# Altium project fpga_board.PrjPcb (part 1 of 2)
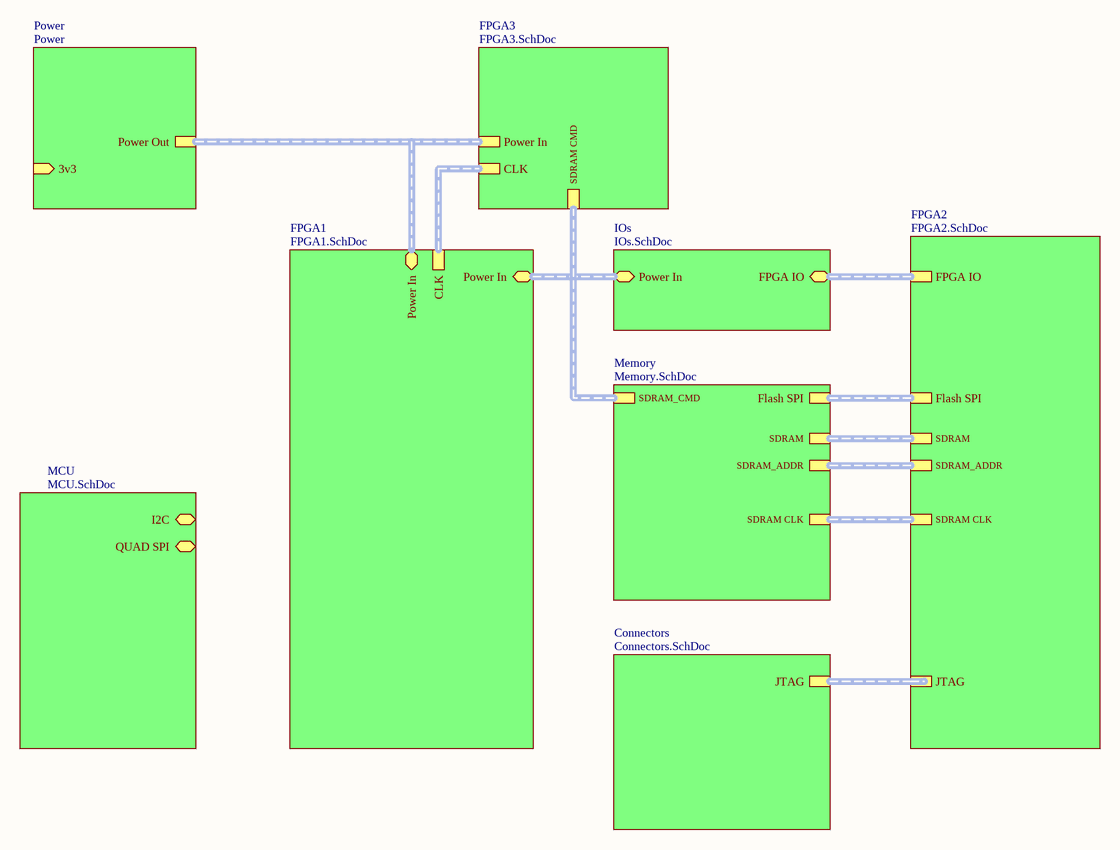
[diagram p0: root.SchDoc]
9 sheets, 164 parts. Net scope: hierarchical (ports join the sheet entries above them; power ports are global).
Board file: fpga_board.PcbDoc
Sheets:
  root.SchDoc
    FPGA1 = FPGA1.SchDoc
    IOs = IOs.SchDoc
    Power = Power.SchDoc
    Memory = Memory.SchDoc
    Connectors = Connectors.SchDoc
    MCU = MCU.SchDoc
    FPGA2 = FPGA2.SchDoc
    FPGA3 = FPGA3.SchDoc

## Sheet root.SchDoc
size A4; SheetNumber: 1; SheetTotal: 9

### Sub-sheets
Connectors = Connectors.SchDoc: JTAG
FPGA1 = FPGA1.SchDoc: Power In (bidir), CLK, Power In (bidir)
FPGA2 = FPGA2.SchDoc: FPGA IO, Flash SPI, SDRAM, SDRAM_ADDR, JTAG, SDRAM CLK
FPGA3 = FPGA3.SchDoc: Power In, CLK, SDRAM CMD
IOs = IOs.SchDoc: FPGA IO (bidir), Power In (bidir)
MCU = MCU.SchDoc: I2C (bidir), QUAD SPI (bidir)
Memory = Memory.SchDoc: Flash SPI, SDRAM, SDRAM_ADDR, SDRAM_CMD, SDRAM CLK
Power = Power: 3v3 (in), Power Out

### Buses and harness runs
harness sheet Connectors/JTAG = sheet FPGA2/JTAG
harness sheet FPGA1/CLK = sheet FPGA3/CLK
harness sheet FPGA1/Power In = sheet FPGA3/Power In = sheet Power/Power Out
harness sheet FPGA1/Power In = sheet IOs/Power In
harness sheet FPGA2/Flash SPI = sheet Memory/Flash SPI
harness sheet FPGA2/FPGA IO = sheet IOs/FPGA IO
harness sheet FPGA2/SDRAM = sheet Memory/SDRAM
harness sheet FPGA2/SDRAM CLK = sheet Memory/SDRAM CLK
harness sheet FPGA2/SDRAM_ADDR = sheet Memory/SDRAM_ADDR
harness sheet FPGA3/SDRAM CMD = sheet Memory/SDRAM_CMD

## Sheet FPGA1.SchDoc
size A4; SheetNumber: 2; SheetTotal: 9
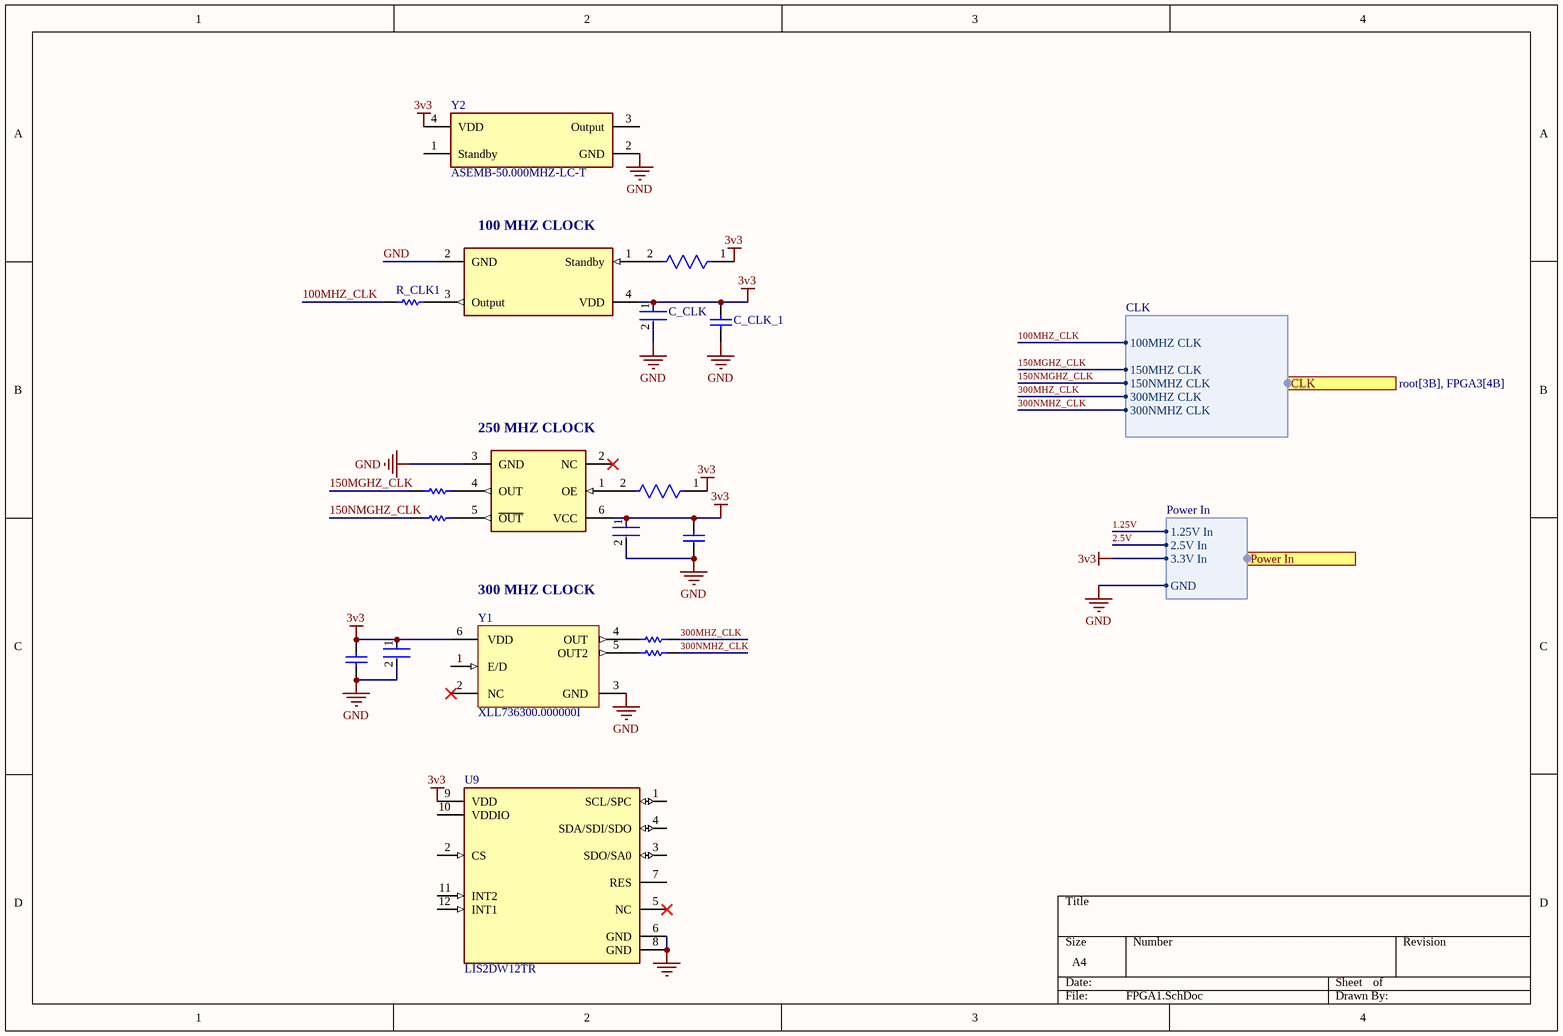
[diagram p1: FPGA1.SchDoc]

### Parts
100MHZ_CLK  ASEM1-100.000MHZ-LC-T  [FP-ASEM-MFG]  (value not drawn)
250_MHZ_CLK  SG3225VAN 250.000000M-KEGA3  [FP-SG3225-MFG]  (value not drawn)
C_CLK  GRM033C71C104KE14D  [FP-GRM033-0_03-MFG]  (value not drawn)
C_CLK_1  C0805C105K8PACTU  [CAPC2013X145X50NL20T25]  (value not drawn)
C_CLK_3  C0805C105K8PACTU  [CAPC2013X145X50NL20T25]  (value not drawn)
C_CLK_4  GRM033C71C104KE14D  [FP-GRM033-0_03-MFG]  (value not drawn)
C_CLK_t5  C0805C105K8PACTU  [CAPC2013X145X50NL20T25]  (value not drawn)
C_CLKt  GRM033C71C104KE14D  [FP-GRM033-0_03-MFG]  (value not drawn)
R_CLK1  CRCW080522R0JNTA  [RESC2013X50X30NL20T20]  (value not drawn)
R_CLK2  CRCW080522R0JNTA  [RESC2013X50X30NL20T20]  (value not drawn)
R_CLK3  CRCW080522R0JNTA  [RESC2013X50X30NL20T20]  (value not drawn)
R_CLK_4  CRCW080522R0JNTA  [RESC2013X50X30NL20T20]  (value not drawn)
R_CLK_5  CRCW080522R0JNTA  [RESC2013X50X30NL20T20]  (value not drawn)
R_STDBY1  RT0402BRE0710KL  [FP-RT0402-MFG]  (value not drawn)
R_STDBY_2  RT0402BRE0710KL  [FP-RT0402-MFG]  (value not drawn)
U9  LIS2DW12TR  [FP-LGA12-DM00170568-MFG]
Y1  XLL736300.000000I  [JU6_MFG]
Y2  ASEMB-50.000MHZ-LC-T  [FP-ASEMB-MFG]

### Ports
CLK (harness CLK, see root[3B], FPGA3[4B]), Power In (harness Power In, see root[2B], FPGA3[4C], IOs[1D])

### Harnesses
Power In: 1.25V In, 2.5V In, 3.3V In, GND
CLK: 100MHZ CLK, 150MHZ CLK, 150NMHZ CLK, 300MHZ CLK, 300NMHZ CLK

### Nets
3v3: 100MHZ_CLK.4(VDD) 250_MHZ_CLK.6(VCC) C_CLK.1 C_CLK_1.2 C_CLK_3.2 C_CLK_4.1 C_CLK_t5.2 C_CLKt.1 R_STDBY1.1 R_STDBY_2.1 U9.9(VDD) Y1.6(VDD) Y2.4(VDD) ; port Power In.3.3V In
GND: 100MHZ_CLK.2(GND) 250_MHZ_CLK.3(GND) C_CLK.2 C_CLK_1.1 C_CLK_3.1 C_CLK_4.2 C_CLK_t5.1 C_CLKt.2 U9.6(GND) U9.8(GND) Y1.3(GND) Y2.2(GND) ; port Power In.GND
1.25V: port Power In.1.25V In
100MHZ_CLK: R_CLK1.1 ; port CLK.100MHZ CLK
150MGHZ_CLK: R_CLK2.1 ; port CLK.150MHZ CLK
150NMGHZ_CLK: R_CLK3.1 ; port CLK.150NMHZ CLK
300MHZ_CLK: R_CLK_5.2 ; port CLK.300MHZ CLK
300NMHZ_CLK: R_CLK_4.2 ; port CLK.300NMHZ CLK
Net100MHZ_CLK_1: 100MHZ_CLK.1(Standby) R_STDBY1.2
Net100MHZ_CLK_3: 100MHZ_CLK.3(Output) R_CLK1.2
Net250_MHZ_CLK_1: 250_MHZ_CLK.1(OE) R_STDBY_2.2
Net250_MHZ_CLK_4: 250_MHZ_CLK.4(OUT) R_CLK2.2
Net250_MHZ_CLK_5: 250_MHZ_CLK.5(~{OUT}) R_CLK3.2
NetR_CLK_4_1: R_CLK_4.1 Y1.5(OUT2)
NetR_CLK_5_1: R_CLK_5.1 Y1.4(OUT)

Not connected (* = marked no-connect by the designer): 250_MHZ_CLK 2(NC)*; U9 1(SCL/SPC) 2(CS) 3(SDO/SA0) 4(SDA/SDI/SDO) 5(NC)* 7(RES) 10(VDDIO) 11(INT2) 12(INT1); Y1 1(E/D) 2(NC)*; Y2 1(Standby) 3(Output)

### Notes on the sheet
- (near 100MHZ_CLK) 100 MHZ CLOCK
- (near 250_MHZ_CLK) 250 MHZ CLOCK
- 300 MHZ CLOCK

### Library data of the parts
100MHZ_CLK = CMP-27762-005945-1: MEMS OSC XO 100.0000MHZ CMOS SMD; Min Supply Voltage: 3V; Frequency: 100MHz; Load Capacitance: 15pF; Max Supply Current: 10mA; Operating Supply Voltage: 3.3V; Max Supply Voltage: 3.6V; Frequency Stability: 50ppm; Min Operating Temperature: -40°C; Radiation Hardening: No; Series: Pure Silicon™ ASEM; Lead Free: Lead Free; Width: 0.098inch; Max Operating Temperature: 85°C; Mount: Surface Mount; Packaging: Tape and Reel; Length: 0.126inch; Number of Pins: 4; Height: 0.035inch; Case/Package: SMD/SMT
250_MHZ_CLK = CMP-36405-000003-1: XTAL OSC XO 250.0000MHZ LVDS SMD; Manufacturer: EPSON; Min Supply Voltage: 2.5V; Max Supply Voltage: 3.3V; Frequency: 250MHz; Max Supply Current: 30mA; Device Class L1: Passive Components; RoHS: TRUE; Lead Free: Yes; Manufacturer Part Number: SG3225VAN 250.000000M-KEGA3; Height: 1.2mm; Temperature: -40°C to +85°C; Mouser Description: Standard Clock Oscillators 250MHz 30ppm -40C +85C; Automotive: No; Temperature Range Low: -40°C; Digikey Description: XTAL OSC XO 250.0000MHZ LVDS SMD; Device Class L2: Crystals / Oscillators; ComponentLink2URL: https://support.epson.biz/td/api/doc_check.php?dl=brief_SG5032VAN&lang=en; Temperature Range High: +85°C; ComponentLink2Description: Datasheet; Series: SG3225; Category: Crys; Octopart: https://octopart.com/sg3225van+250.000000m-kega3-epson-56783964; Package: SG3225; Device Class L3: Oscillators
C_CLK C_CLK_4 C_CLKt = CMP-06035-019037-1: Chip Multilayer Ceramic Capacitors for General Purpose, 0201, 0.10uF, X7S, 22%, 10%, 16V; Capacitance: 100nF; Dielectric: X7S; Tolerance: 10%; Voltage Rating (DC): 16V; Height: 0.3mm; Max Operating Temperature: 125°C; Case Code (Metric): 0603; Termination: SMD/SMT; Min Operating Temperature: -55°C; Mount: Surface Mount; Case/Package: 0201; Weight: 1.2E-05oz; Package Quantity: 15000; Length: 0.024inch; Voltage Rating: 16V; Case Code (Imperial): 0201; Packaging: Tape and Reel; Thickness: 0.013inch; Width: 0.3mm
C_CLK_1 C_CLK_3 C_CLK_t5 = CMP-2007-01022-1: Manufacturer: Kemet; Part Number: C0805C105K8PACTU
R_CLK1-R_CLK3 R_CLK_4 R_CLK_5 = CMP-2001-03694-1: Manufacturer: Vishay Dale; Part Number: CRCW080522R0JNTA
R_STDBY1 R_STDBY_2 = CMP-2002-02973-2: RES SMD 10K OHM 0.1% 1/16W 0402; Manufacturer: Yageo; Power Rating: 0.063W; Resistance: 10KΩ; Temperature Coefficient: 50 ppm/°C; Tolerance: 0.001; Voltage Rating: 50V; Value: 10KΩ; Octopart: https://octopart.com/rt0402bre0710kl-yageo-1416557; Digikey Description: RES SMD 10K OHM 0.1% 1/16W 0402; Category: Res; Temperature Range Low: -55°C; Ipc Land Pattern Name: RESC10050X30; Manufacturer Part Number: RT0402BRE0710KL; Automotive: No; Package: RT0402; Temperature: -55°C to +155°C; Series: RT; Lead Free: Yes; Device Class L3: Chip SMD Resistors; ComponentLink2URL: http://www.yageo.com/documents/recent/PYu-RT_1-to-0.01_RoHS_L_9.pdf; Height: 0.35mm; ComponentLink2Description: Datasheet; RoHS: TRUE; Composition: Thin Film; Device Class L2: Resistors; Device Class L1: Passive Components; Temperature Range High: +155°C; Footprint Url: http://www.yageo.com/exep/pages/download/literatures/PYu-R_Mount_10.pdf; Mouser Description: Res Thin Film 0402 10K Ohm 0.1% 1/16W ±50ppm/°C Molded SMD Paper T/R
U9 = CMP-12175-000006-1: ACCEL 2-16G I2C/SPI 12LGA; Manufacturer: STMicroelectronics; Min Supply Voltage: 1.62V; Operating Supply Current: 0.38-90uA; Sensor Output: I2C,SPI; Accel Resolution: 14bits; Max Supply Voltage: 3.6V; Accel Range: 2/4/8/16g; Height: 0.7mm; Device Class L1: Sensors; RoHS: TRUE; Temperature Range Low: -40°C; Category: IC; Mouser Description: Accelerometer Triple ±2g/±4g/±8g/±16g 1.62V to 3.6V 0.244mg/digit/0.488mg/digit/0.976mg/digit/1.952mg/digit 12-Pin LG...; Digikey Description: ACCEL 2-16G I2C/SPI 12LGA; ComponentLink2URL: https://www.st.com/resource/en/datasheet/lis2dw12.pdf; Automotive: No; Manufacturer Part Number: LIS2DW12TR; Lead Free: Yes; Footprint Url: https://www.st.com/content/ccc/resource/technical/document/technical_note/73/17/9c/16/dd/96/4a/01/CD00134799.pdf/files/CD00134799.pdf/jcr:content/translations/en.CD00134799.pdf; Temperature: -40°C to +85°C; Device Class L3: Accelerometers; Package: LGA12-DM00170568; Temperature Range High: +85°C; Device Class L2: Motion Sensors; Octopart: https://octopart.com/lis2dw12tr-stmicroelectronics-77080925; ComponentLink2Description: Datasheet
Y1 = CMP-00572-106942874-3: Renesas XL Family of Low Phase Noise Quartz-based PLL Oscillators; Min Input Voltage: 3.135V; Max Input Voltage: 3.465V; Max Output Frequency: 999.9MHz; Output Type: LVDS; Height: 1.45mm; ComponentLink1Description: Manufacturer's Website; Case/Package: CLCC; ComponentLink2URL: https://octopart.com/cad-content/api/get-model-datasheet/15189/106942874; ComponentLink2Description: Datasheet URL; RoHS: Compliant; Number of Pins: 6; Mount: Surface Mount; ComponentLink3Description: Manufacturer's Package Drawing; Max Operating Temperature: 85°C; Min Operating Temperature: -40°C; HelpURL: https://octopart.com/cad-content/api/get-model-datasheet/15189/106942874; ComponentLink3URL: https://www.renesas.com/en/document/psc/ju6-package-outline-70-x-50-mm-body-13-mm-thick; ComponentLink1URL: http://www.renesas.com
Y2 = CMP-27762-007622-1: MEMS OSC XO 50.0000MHZ CMOS SMD; Operating Supply Voltage: 3.3V; Frequency Stability: 50ppm; Frequency: 50MHz; Max Supply Voltage: 4V; Load Capacitance: 15pF; Max Supply Current: 16mA; Min Supply Voltage: -300mV; Min Operating Temperature: -40°C; Mount: Surface Mount; Lead Free: Lead Free; Series: Pure Silicon™ ASEMB; Termination: SMD/SMT; Number of Pins: 4; REACH SVHC: No SVHC; Width: 0.098inch; Case/Package: SMD/SMT; Length: 0.126inch; Packaging: Tape and Reel; Max Operating Temperature: 85°C; Height: 0.035inch

## Sheet IOs.SchDoc
size A4; SheetNumber: 3; SheetTotal: 9
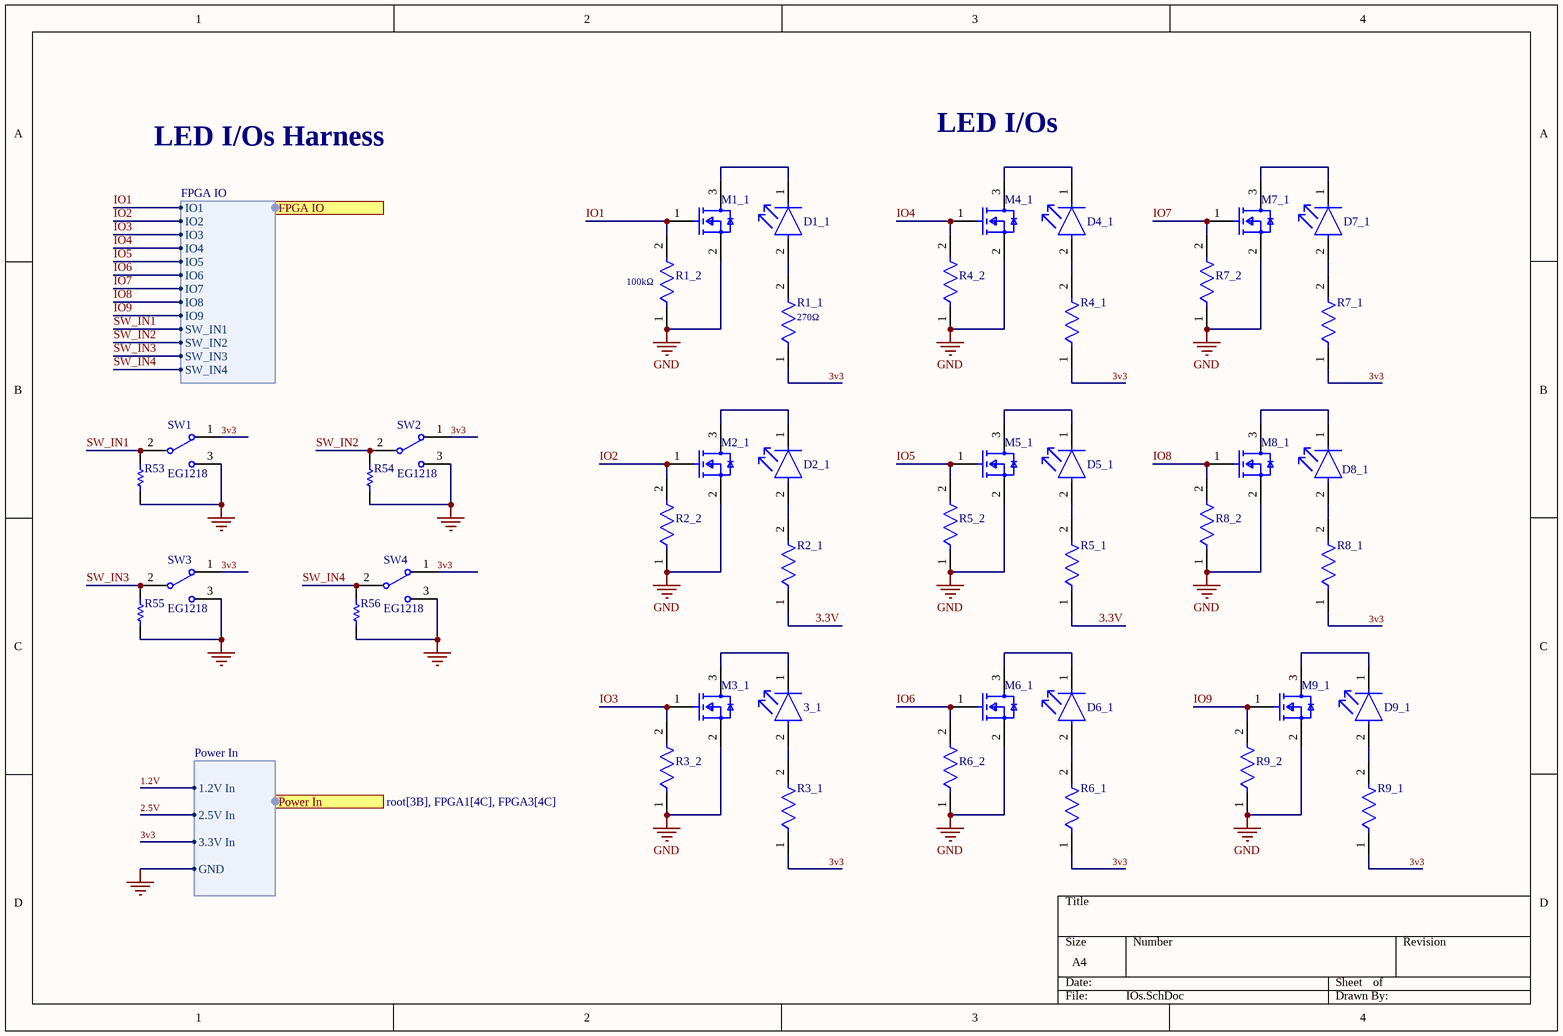
[diagram p2: IOs.SchDoc]

### Parts
3_1  LW T6SH.CB-CZEY-FK0PM0-Z664  [FP-LW_T6SH_CB-CZEY-FK0PM0-MFG]  (value not drawn)
D1_1  LW T6SH.CB-CZEY-FK0PM0-Z664  [FP-LW_T6SH_CB-CZEY-FK0PM0-MFG]  (value not drawn)
D2_1  LW T6SH.CB-CZEY-FK0PM0-Z664  [FP-LW_T6SH_CB-CZEY-FK0PM0-MFG]  (value not drawn)
D4_1  LW T6SH.CB-CZEY-FK0PM0-Z664  [FP-LW_T6SH_CB-CZEY-FK0PM0-MFG]  (value not drawn)
D5_1  LW T6SH.CB-CZEY-FK0PM0-Z664  [FP-LW_T6SH_CB-CZEY-FK0PM0-MFG]  (value not drawn)
D6_1  LW T6SH.CB-CZEY-FK0PM0-Z664  [FP-LW_T6SH_CB-CZEY-FK0PM0-MFG]  (value not drawn)
D7_1  LW T6SH.CB-CZEY-FK0PM0-Z664  [FP-LW_T6SH_CB-CZEY-FK0PM0-MFG]  (value not drawn)
D8_1  LW T6SH.CB-CZEY-FK0PM0-Z664  [FP-LW_T6SH_CB-CZEY-FK0PM0-MFG]  (value not drawn)
D9_1  LW T6SH.CB-CZEY-FK0PM0-Z664  [FP-LW_T6SH_CB-CZEY-FK0PM0-MFG]  (value not drawn)
M1_1  SI2342DS-T1-GE3  [FP-S-03946-MFG]  (value not drawn)
M2_1  SI2342DS-T1-GE3  [FP-S-03946-MFG]  (value not drawn)
M3_1  SI2342DS-T1-GE3  [FP-S-03946-MFG]  (value not drawn)
M4_1  SI2342DS-T1-GE3  [FP-S-03946-MFG]  (value not drawn)
M5_1  SI2342DS-T1-GE3  [FP-S-03946-MFG]  (value not drawn)
M6_1  SI2342DS-T1-GE3  [FP-S-03946-MFG]  (value not drawn)
M7_1  SI2342DS-T1-GE3  [FP-S-03946-MFG]  (value not drawn)
M8_1  SI2342DS-T1-GE3  [FP-S-03946-MFG]  (value not drawn)
M9_1  SI2342DS-T1-GE3  [FP-S-03946-MFG]  (value not drawn)
R1_1  270Ω  [FP-CR0402-IPC_A]
R1_2  100kΩ  [FP-TFCR0402-IPC_B]
R2_1  CR0402-JW-271GLF  [FP-CR0402-IPC_A]  (value not drawn)
R2_2  100kΩ  [FP-TFCR0402-IPC_B]  (value not drawn)
R3_1  CR0402-JW-271GLF  [FP-CR0402-IPC_A]  (value not drawn)
R3_2  100kΩ  [FP-TFCR0402-IPC_B]  (value not drawn)
R4_1  CR0402-JW-271GLF  [FP-CR0402-IPC_A]  (value not drawn)
R4_2  100kΩ  [FP-TFCR0402-IPC_B]  (value not drawn)
R5_1  CR0402-JW-271GLF  [FP-CR0402-IPC_A]  (value not drawn)
R5_2  100kΩ  [FP-TFCR0402-IPC_B]  (value not drawn)
R6_1  CR0402-JW-271GLF  [FP-CR0402-IPC_A]  (value not drawn)
R6_2  100kΩ  [FP-TFCR0402-IPC_B]  (value not drawn)
R7_1  CR0402-JW-271GLF  [FP-CR0402-IPC_A]  (value not drawn)
R7_2  100kΩ  [FP-TFCR0402-IPC_B]  (value not drawn)
R8_1  CR0402-JW-271GLF  [FP-CR0402-IPC_A]  (value not drawn)
R8_2  100kΩ  [FP-TFCR0402-IPC_B]  (value not drawn)
R9_1  CR0402-JW-271GLF  [FP-CR0402-IPC_A]  (value not drawn)
R9_2  100kΩ  [FP-TFCR0402-IPC_B]  (value not drawn)
R53  3K3 5% 0603(1608)  [RESC0603(1608)_N]  (value not drawn)
R54  3K3 5% 0603(1608)  [RESC0603(1608)_N]  (value not drawn)
R55  3K3 5% 0603(1608)  [RESC0603(1608)_N]  (value not drawn)
R56  3K3 5% 0603(1608)  [RESC0603(1608)_N]  (value not drawn)
SW1  EG1218  [ESWI-EG1218_V]
SW2  EG1218  [ESWI-EG1218_V]
SW3  EG1218  [ESWI-EG1218_V]
SW4  EG1218  [ESWI-EG1218_V]

### Ports
FPGA IO (harness FPGA IO, see root[4B], FPGA2[3A]), Power In (harness Power In, see root[3B], FPGA1[4C], FPGA3[4C])

### Harnesses
FPGA IO: IO1, IO2, IO3, IO4, IO5, IO6, IO7, IO8, IO9, SW_IN1, SW_IN2, SW_IN3, SW_IN4
Power In: 1.2V In, 2.5V In, 3.3V In, GND

### Nets
3v3: R1_1.1 R3_1.1 R4_1.1 R6_1.1 R7_1.1 R8_1.1 R9_1.1 SW1.1 SW2.1 SW3.1 SW4.1 ; port Power In.3.3V In
GND: M1_1.2(S) M2_1.2(S) M3_1.2(S) M4_1.2(S) M5_1.2(S) M6_1.2(S) M7_1.2(S) M8_1.2(S) M9_1.2(S) R1_2.1 R2_2.1 R3_2.1 R4_2.1 R5_2.1 R6_2.1 R7_2.1 R8_2.1 R9_2.1 R53.1 R54.1 R55.1 R56.1 SW1.3 SW2.3 SW3.3 SW4.3 ; port Power In.GND
3.3V: R2_1.1 R5_1.1
IO1: M1_1.1(G) R1_2.2 ; port FPGA IO.IO1
IO2: M2_1.1(G) R2_2.2 ; port FPGA IO.IO2
IO3: M3_1.1(G) R3_2.2 ; port FPGA IO.IO3
IO4: M4_1.1(G) R4_2.2 ; port FPGA IO.IO4
IO5: M5_1.1(G) R5_2.2 ; port FPGA IO.IO5
IO6: M6_1.1(G) R6_2.2 ; port FPGA IO.IO6
IO7: M7_1.1(G) R7_2.2 ; port FPGA IO.IO7
IO8: M8_1.1(G) R8_2.2 ; port FPGA IO.IO8
IO9: M9_1.1(G) R9_2.2 ; port FPGA IO.IO9
SW_IN1: R53.2 SW1.2(COM) ; port FPGA IO.SW_IN1
SW_IN2: R54.2 SW2.2(COM) ; port FPGA IO.SW_IN2
SW_IN3: R55.2 SW3.2(COM) ; port FPGA IO.SW_IN3
SW_IN4: R56.2 SW4.2(COM) ; port FPGA IO.SW_IN4
Net3_1_1: 3_1.1(C) M3_1.3(D)
Net3_1_2: 3_1.2(A) R3_1.2
NetD1_1_1: D1_1.1(C) M1_1.3(D)
NetD1_1_2: D1_1.2(A) R1_1.2
NetD2_1_1: D2_1.1(C) M2_1.3(D)
NetD2_1_2: D2_1.2(A) R2_1.2
NetD4_1_1: D4_1.1(C) M4_1.3(D)
NetD4_1_2: D4_1.2(A) R4_1.2
NetD5_1_1: D5_1.1(C) M5_1.3(D)
NetD5_1_2: D5_1.2(A) R5_1.2
NetD6_1_1: D6_1.1(C) M6_1.3(D)
NetD6_1_2: D6_1.2(A) R6_1.2
NetD7_1_1: D7_1.1(C) M7_1.3(D)
NetD7_1_2: D7_1.2(A) R7_1.2
NetD8_1_1: D8_1.1(C) M8_1.3(D)
NetD8_1_2: D8_1.2(A) R8_1.2
NetD9_1_1: D9_1.1(C) M9_1.3(D)
NetD9_1_2: D9_1.2(A) R9_1.2

### Notes on the sheet
- LED I/Os Harness
- LED I/Os

### Library data of the parts
3_1 D1_1 D2_1 D4_1 D5_1 D6_1 D7_1 D8_1 D9_1 = CMP-62016-000075-1: TOPLED
M1_1 M2_1 M3_1 M4_1 M5_1 M6_1 M7_1 M8_1 M9_1 = CMP-02550-000018-1: MOSFET N-CH 8V 6A SOT-23; Manufacturer: Vishay; Number Of N Channels: 1; Pulse Drain Current: 30A; Reverse Recovery Charge: 17nC; Depletion Mode: False; Reverse Recovery Time: 40ns; Max Junction Temp: +150°C; Power Dissipation: 1.3W; Transconductance: 75S; Threshold Vgs Min: 0.35V; Turn Off Delay Time: 65ns; Rthja Max: 75°C/W; Input Capacitace At Vds: 1070pF @ 4V; Gate Charge At Vgs: 10.5nC @ 4.5V; Gate To Source Voltage: 5V; Turn On Delay Time: 6ns; Drain To Source Resistance: 0.014Ω; Typ Forward Diode Voltage: 0.82V; Standoff Height: 0.01mm; Max Forward Diode Voltage: 1.2V; Threshold Vgs Max: 0.8V; Continuous Drain Current: 6A; Device Class L1: Discrete Semiconductors; Mouser Description: MOSFET 8V 6A 2.5; Category: Trans; Digikey Description: MOSFET N-CH 8V 6A SOT-23; Manufacturer Part Number: SI2342DS-T1-GE3; Device Class L2: Transistors; Octopart: https://octopart.com/si2342ds-t1-ge3-vishay-45050957; ComponentLink2URL: https://www.vishay.com/docs/63302/si2342ds.pdf; RoHS: TRUE; Drain To Source Breakdown Voltage: 8V; Height: 1.12mm; Lead Free: Yes; Temperature Range Low: -55°C; Package: S-03946; Device Class L3: MOSFETs; Temperature Range High: +150°C; Ipc Land Pattern Name: SOT95P237X100-3; Drain To Source Voltage: 8V; Temperature: -55°C to +150°C; ComponentLink2Description: Datasheet; Number Of Channels: 1; Automotive: No
R1_1 R2_1 R3_1 R4_1 R5_1 R6_1 R7_1 R8_1 R9_1 = CMP-2002-05589-2: Thick Film Chip Resistors 0402 270Ω 0.0625W 5% 200ppm/°C; Voltage Rating: 50V; Power Rating: 62.5mW; Resistance: 270R; Composition: Thick Film; Tolerance: 5%; Military Standard: Not; Temperature Coefficient: 200ppm/°C; Width: 0.5mm; Case/Package: 0402; Thickness: 356um; Termination: SMD/SMT; Case Code (Imperial): 0402; Contact Plating: Tin; Max Operating Temperature: 125°C; Packaging: Tape and Reel; Package Quantity: 10000; Length: 1mm; Min Operating Temperature: -55°C; Height: 0.35mm; Case Code (Metric): 1005; Mount: Surface Mount; Radiation Hardening: No; Depth: 0.5mm
R1_2 R2_2 R3_2 R4_2 R5_2 R6_2 R7_2 R8_2 R9_2 = CMP-250906-202248-1: RES Thin Film,  100kΩ, 0.5%, 0.063W, 25ppm/°C, 0402
R53-R56 = CMP-1012-00086-1: 3K3 0.1W 5% 0603 (1608 Metric)  SMD; Case-EIA: 0603; Value: 3300.00 Ohm; Case-Metric: 1608; Technology: SMT; Tolerance: 5 %; Power: 0.1 W
SW1-SW4 = CMP-1696-00002-1: Slide Switch, 500 V, -20 to 70 degC, 3-Pin THD, RoHS; Case\Package: SOT-23-5; Output Current: 150 mA; Nominal Output Voltage: 3.3 V; Max Power Dissipation: 250 mW; Min Input Voltage: 4.3 V; Outputs: 1; Max Input Voltage: 8 V; Dropout Voltage: 300 mV; PackageDescription: 3-Pin Through Hole Device, Body 11.6 x 4 mm, Pitch 2.5 mm; ComponentLink1URL: http://www.e-switch.ch/en/; RoHSCompliant: true; Length: 3 mm; ComponentLink1Description: Manufacturer URL; Power Rating: 250 mW; Mount: Surface Mount; Max Operating Temperature: 85 degC; REACH SVHC: No SVHC; Radiation Hardening: No; Height: 1.3 mm; Pins: 5; Max Ouput Current: 150 mA; Output Voltage: 3.3 V; Width: 1.8 mm; Package Quantity: 3000; ComponentLink2URL: https://www.e-switch.com/system/asset/product_line/data_sheet/119/EG.pdf; Min Operating Temperature: -40 degC; ComponentLink2Description: Datasheet; DatasheetVersion: Oct-15; PackageReference: EG1218; Packaging: Tape and Reel

## Sheet Power.SchDoc
size A4; SheetNumber: 4; SheetTotal: 9
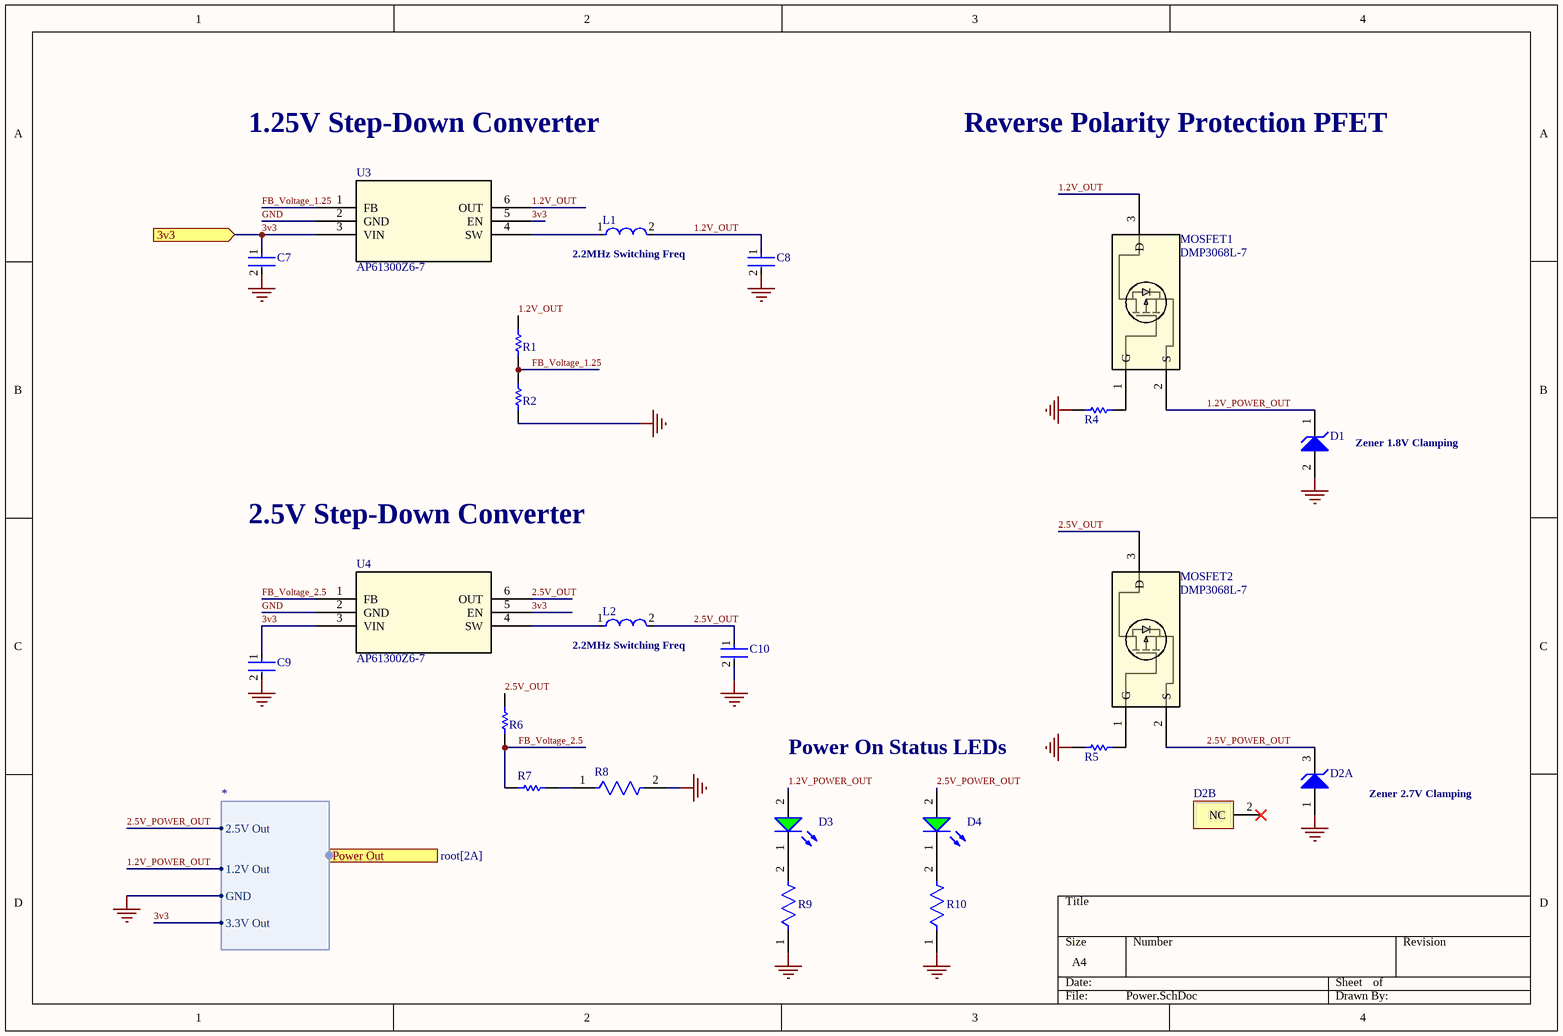
[diagram p3: Power.SchDoc]

### Parts
C7  GRT21BR61E226ME13L  [FP-GRT21B-0_2-IPC_C]  (value not drawn)
C8  GRT21BR61E226ME13L  [FP-GRT21B-0_2-IPC_C]  (value not drawn)
C9  GRT21BR61E226ME13L  [FP-GRT21B-0_2-IPC_C]  (value not drawn)
C10  GRT21BR61E226ME13L  [FP-GRT21B-0_2-IPC_C]  (value not drawn)
D1  SZMMSZ4678T1G  [ONSC-SOD-123-2-425-04_V]  (value not drawn)
D2  MMBZ5223BLT1G  [ONSC-SOT-23-3-318-08_V]  (value not drawn)  (parts A,B of 2)
D3  150060VS75000  [WL-SMCW_0603_150060xx75000]  (value not drawn)
D4  150060VS75000  [WL-SMCW_0603_150060xx75000]  (value not drawn)
L1  MLP2012H2R2MT0S1  [FP-MLP2012M-IPC_C]  (value not drawn)
L2  MLP2012H2R2MT0S1  [FP-MLP2012M-IPC_C]  (value not drawn)
MOSFET1  DMP3068L-7  [SOT-23_DMP3068L_DIO]
MOSFET2  DMP3068L-7  [SOT-23_DMP3068L_DIO]
R1  ERJ-2RKF2003X  [RESC1005X40X25NL05T05]  (value not drawn)
R2  RC0402FR-07100KL  [RESC1005X40X25NL05T10]  (value not drawn)
R4  RC0402FR-07100KL  [RESC1005X40X25NL05T10]  (value not drawn)
R5  RC0402FR-07100KL  [RESC1005X40X25NL05T10]  (value not drawn)
R6  ERJ-2RKF2003X  [RESC1005X40X25NL05T05]  (value not drawn)
R7  RC0402FR-0744K2L  [RESC1005X40X25NL05T10]  (value not drawn)
R8  RC0402FR-0720KL  [FP-RC0402-0_4-MFG]  (value not drawn)
R9  RC0603FR-0710KL  [FP-RC0603-0_55-IPC_C]  (value not drawn)
R10  RC0603FR-0710KL  [FP-RC0603-0_55-IPC_C]  (value not drawn)
U3  AP61300Z6-7  [AP61300Z6-7_DIO]
U4  AP61300Z6-7  [AP61300Z6-7_DIO]

### Ports
3v3 (in, see root[2A]), Power Out (harness *, see root[2A])

### Harnesses
*: 2.5V Out, 1.2V Out, GND, 3.3V Out

### Nets
GND: C7.2 C8.2 C9.2 C10.2 D1.2(A) D2.1(A) R2.2 R4.2 R5.2 R8.2 R9.1 R10.1 U3.2(GND) U4.2(GND) ; port Power Out.GND
1.2V_OUT: C8.1 L1.2 MOSFET1.3(D) R1.1 U3.6(OUT)
1.2V_POWER_OUT: D1.1(K) D3.2(A) MOSFET1.2(S) ; port Power Out.1.2V Out
2.5V_OUT: C10.1 L2.2 MOSFET2.3(D) R6.1 U4.6(OUT)
2.5V_POWER_OUT: D2.3(K) D4.2(A) MOSFET2.2(S) ; port Power Out.2.5V Out
3v3: C7.1 C9.1 U3.3(VIN) U3.5(EN) U4.3(VIN) U4.5(EN) ; port 3v3, port Power Out.3.3V Out
FB_Voltage_1.25: R1.2 R2.1 U3.1(FB)
FB_Voltage_2.5: R6.2 R7.1 U4.1(FB)
NetD3_1: D3.1(K) R9.2
NetD4_1: D4.1(K) R10.2
NetL1_1: L1.1 U3.4(SW)
NetL2_1: L2.1 U4.4(SW)
NetMOSFET1_1: MOSFET1.1(G) R4.1
NetMOSFET2_1: MOSFET2.1(G) R5.1
NetR7_2: R7.2 R8.1

Not connected (* = marked no-connect by the designer): D2 2(NC)*

### Notes on the sheet
- 1.25V Step-Down Converter
- Reverse Polarity Protection PFET
- (near L1) 2.2MHz Switching Freq
- (near D1) Zener 1.8V Clamping
- 2.5V Step-Down Converter
- (near L2) 2.2MHz Switching Freq
- Power On Status LEDs
- Zener 2.7V Clamping

### Library data of the parts
C7-C10 = CMP-06035-011672-1: Multi-Layer Ceramic Capacitor 22uF 25V X5R ±20% 0805 Emboss T/R; Mount: Surface Mount; Case/Package: 0805; Min Operating Temperature: -55°C; Thickness: 0.057inch; Max Operating Temperature: 85°C; Case Code (Imperial): 0805; Voltage Rating: 25V; Length: 0.079inch; Ratings: AEC-Q200; Case Code (Metric): 2012; Capacitance: 22uF; Width: 0.049inch; Packaging: Tape and Reel; Tolerance: 20%
D1 = CMP-1060-00510-1: Zener Voltage Regulator, 500 mW, 2-Pin SOD-123, Pb-Free, Tape and Reel; Manufacturer: On Semiconductor; VZ Typ (V): 1.8; P Max (W): 0.5; PartNumber: SZMMSZ4678T1G; PackageDescription: 2-Pin SOD, Body 1.6 x 2.69 mm; Mounting Technology: Surface Mount; ComponentLink2URL: http://www.onsemi.com/pub_link/Collateral/MMSZ4678T1-D.PDF; ComponentLink1URL: http://www.onsemi.com/; DatasheetVersion: Rev. 9; PackageVersion: Rev. G, 10/2009; ComponentLink3Description: Package Specification; ComponentLink2Description: Datasheet; Packing: Tape and Reel; ComponentLink3URL: http://www.onsemi.com/pub_link/Collateral/425-04.PDF; RoHS: Pb-Free; PackageReference: SOD-123-2-425-04; ComponentLink1Description: Manufacturer URL
D2 = CMP-1060-01004-1: Zener Voltage Regulator, 225 mW, 3-Pin SOT-23, Pb-Free, Tape and Reel; Manufacturer: On Semiconductor; VZ Typ (V): 2.7; DatasheetVersion: Rev. 12; ComponentLink2Description: Datasheet; PackageVersion: Rev. AP, 11/2009; RoHS: Pb-Free; Packing: Tape and Reel; PackageReference: SOT-23-3-318-08; PackageDescription: 3-Pin Small Outline Transistor, Body 2.92 x 1.3 mm, Pitch 0.95 mm; ComponentLink1URL: http://www.onsemi.com/; ComponentLink3Description: Package Specification; ComponentLink2URL: http://www.onsemi.cn/pub_link/Collateral/MMBZ5221BLT1-D.PDF; PartNumber: MMBZ5223BLT1G; Mounting Technology: Surface Mount; ComponentLink1Description: Manufacturer URL; ComponentLink3URL: http://www.onsemi.cn/pub_link/Collateral/318-08.PDF
D3 D4 = CMP-1426-00006-7: WURTH ELEKTRONIK - 150060VS75000 - LED, Green, SMD, 0603, 30 mA, 2 V, 570 nm; Reverse Voltage: 5V; Power Dissipation: 72mW; Dominant Wavelength: 570nm; Peak Wavelength: 572nm; Forward Current: 100mA; Forward Voltage: 2V; Lens Style: Clear, Rectangular; Test Current: 20mA; Max Junction Temperature (Tj): 95°C; Viewing Angle: 140°; Luminous Intensity: 40mcd; Height: 700µm; Width: 800µm; Length: 1.6mm; Mount: Surface Mount; Min Operating Temperature: -40°C; Max Reverse Voltage (DC): 5V; Case Code (Imperial): 0603; Wavelength: 570nm; Color: Green; REACH SVHC: Unknown; RoHS: Compliant; Max Operating Temperature: 85°C; Packaging: Tape and Reel; Case/Package: 0603; Number of Pins: 2; Case Code (Metric): 1608
L1 L2 = CMP-08253-000154-1: Shielded Multilayer Inductor 2.2uH ±20% 1000mA 195mΩ SMD 0805; DC Resistance (DCR): 195mR; Core Material: Ferrite; Test Frequency: 2MHz; Current Rating: 1A; Packaging: Tape and Reel; Length: 0.079inch; Tolerance: 20%; Case/Package: 0805; Case Code (Imperial): 0805; Min Operating Temperature: -40°C; Inductance: 2.2uH; Case Code (Metric): 2012; Shielding: Shielded; Mount: Surface Mount; Lead Free: Lead Free; Height - Seated (Max): 0.039inch; Max Operating Temperature: 125°C; RoHS Compliant: Yes; Package Quantity: 4000; Width: 0.049inch
MOSFET1 MOSFET2 = DMP3068L-7: No Description Available; Manufacturer_Name: Diodes Inc; Copyright: Copyright (C) 2025 Ultra Librarian. All rights reserved.; Manufacturer_Part_Number: DMP3068L-7; RefDes: RefDes; Type: Type
R1 R6 = CMP-1011-00768-4: Chip Resistor, 200 KOhm, +/- 1%, 100 mW, -55 to 155 degC, 0402 (1005 Metric), RoHS, Tape and Reel; Manufacturer: Basic Passives; Case\/Package: 0402; Voltage Rating: 50 V; Power Rating: 100 mW; RoHSCompliant: true; Length: 1 mm; DatasheetVersion: 04/2015; ComponentLink2URL: http://industrial.panasonic.com/cdbs/www-data/pdf/RDA0000/AOA0000C86.pdf; Mount: Surface Mount; PackageDescription: 2-Pin Surface Mount Device, Body 1 x 0.5 mm; PartNumber: ERJ-2RKF2003X; Tolerance: 1%; Width: 0.5 mm; ComponentLink2Description: Datasheet; Packaging: Tape and Reel; REACH SVHC: No SVHC; Min Operating Temperature: -55 degC; Package Quantity: 10000; ComponentLink1Description: Manufacturer URL; Height: 0.35 mm; ComponentLink1URL: http://www.panasonic.com/; Mounting Technology: Surface Mount; Case Code (Imperial): 0402; PackageReference: 0402; Radiation Hardening: No; Pins: 2; Max Operating Temperature: 155 degC; Resistance: 200 KOhm; Case Code (Metric): 1005
R2 R4 R5 = CMP-2002-07343-1: Manufacturer: Yageo / Phycomp; Part Number: RC0402FR-07100KL
R7 = CMP-2002-07122-1: Manufacturer: Yageo / Phycomp; Part Number: RC0402FR-0744K2L
R8 = CMP-2002-07501-2: NexarPartId: 39794396; Resistance: 20kΩ; Max Power Dissipation: 63mW; Voltage Rating: 50V; Temperature Coefficient: 100ppm/°C; Power Rating: 62.5mW; Tolerance: 1%; Termination: SMD/SMT; Features: Moisture Resistant; Max Operating Temperature: 155°C; Number of Pins: 2; Length: 1mm; Min Operating Temperature: -55°C; RoHS: Compliant; Width: 500µm; Composition: Thick Film; Case/Package: 0402; Depth: 500µm; Lead Free: Lead Free; Height: 350µm; Packaging: Tape & Reel; Military Standard: Not; Case Code (Imperial): 0402; Case Code (Metric): 1005; Schedule B: 8533210045, 8533210045; Number of Terminations: 2; Voltage Rating (DC): 50V; REACH SVHC: No SVHC
R9 R10 = CMP-2100-03664-2: RES 10K OHM 1% 1/10W 0603; Voltage Rating: 75V; Voltage Rating (DC): 50V; Resistance: 10kR; Power Rating: 100mW; Temperature Coefficient: 100ppm/°C; Depth: 0.8mm; Termination: SMD/SMT; Resistor Type: Thick Film; Series: RC; Construction: Rectangular; Features: Moisture Resistant; Packaging: Tape and Reel; Min Operating Temperature: -55°C; Number of Terminations: 2; Lead Pitch: 0.3mm; RoHS Compliant: Yes; Case/Package: 0603; Resistance Tolerance: 1%; Military Standard: Not; Weight: 7.1E-05oz; Number of Pins: 2; Tolerance: 1%; Length: 1.6mm; Case Code (Imperial): 0603; Lead Free: Lead Free; Width: 0.8mm; Max Power Dissipation: 100mW; Height: 0.45mm; Max Operating Temperature: 155°C; Case Code (Metric): 1608; Size Code: 0603
U3 U4 = AP61300Z6-7: No Description Available; Manufacturer_Name: Diodes Inc; Copyright: Copyright (C) 2025 Ultra Librarian. All rights reserved.; Manufacturer_Part_Number: AP61300Z6-7; RefDes: RefDes; Type: Type

## Sheet Memory.SchDoc
size A4; SheetNumber: 5; SheetTotal: 9
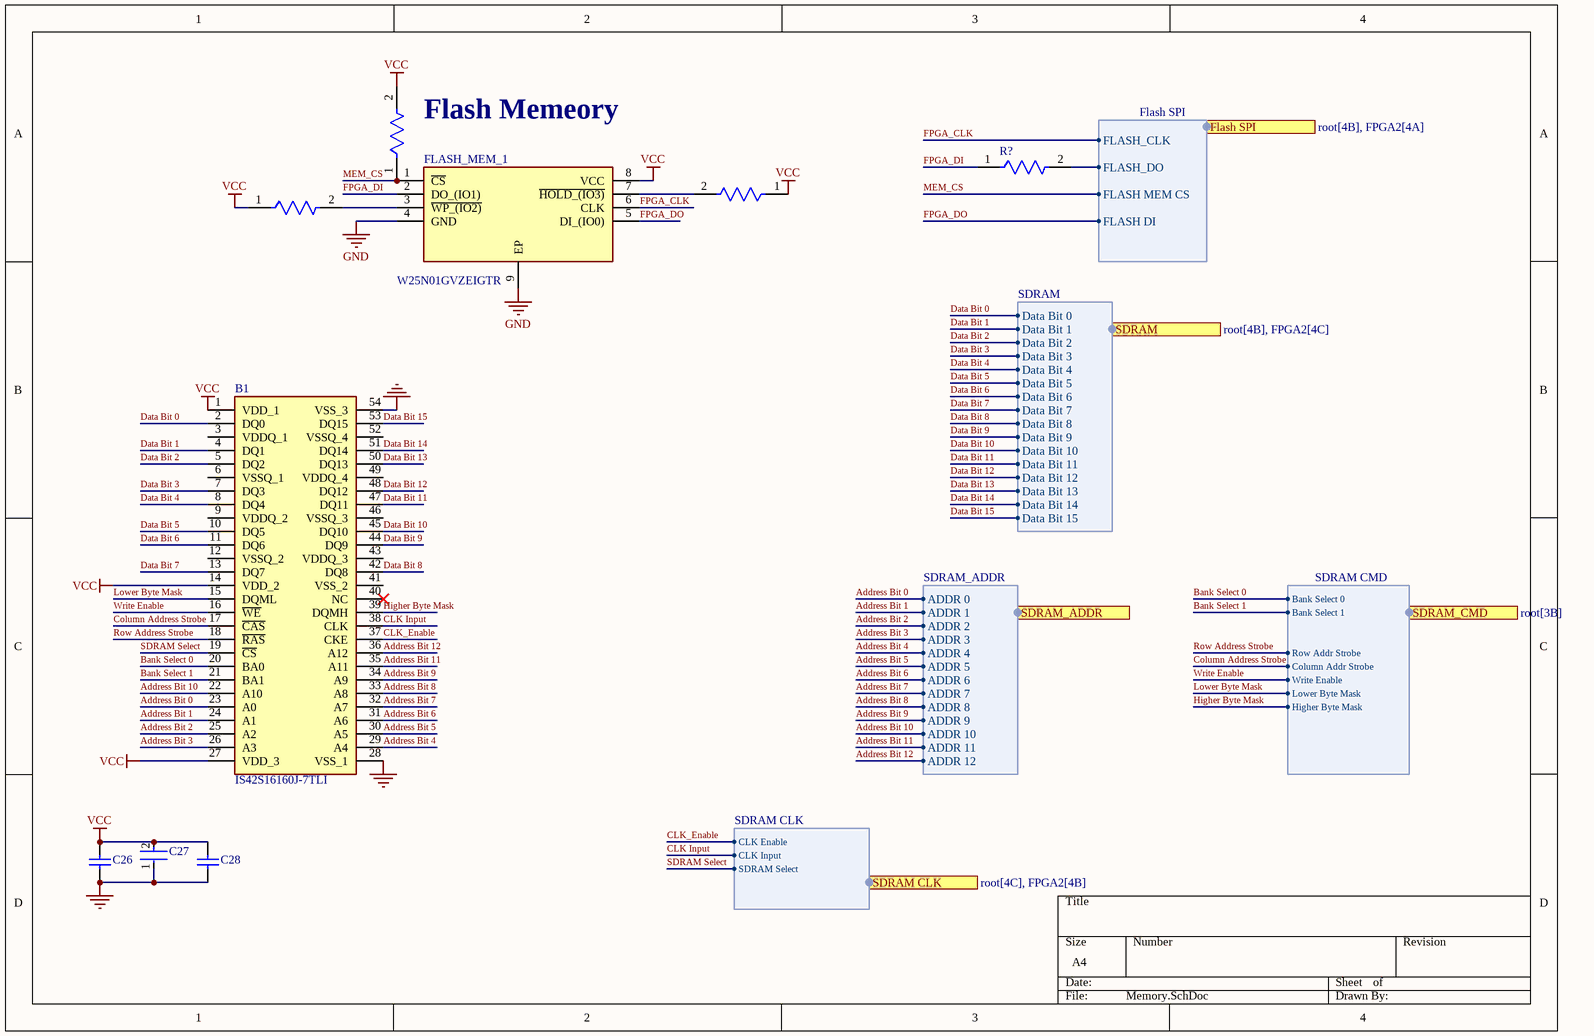
[diagram p4: Memory.SchDoc]

### Parts
(Parts that share a designator on the sheet are numbered #1, #2 ... from top to bottom, then left to right.)
B1  IS42S16160J-7TLI  [SOP80P1176X120-54N]
C26  LD033C104KAB2A  [CAPC1608X90X35NL15T15]  (value not drawn)
C27  GRM219R61E475MA73J  [FP-GRM219-0_15-0_1-IPC_B]  (value not drawn)
C28  C0603C105K9PACTU  [CAPC1608X90X35LL15T15]  (value not drawn)
FLASH_MEM_1  W25N01GVZEIGTR  [SON127P800X600X80-9N-D]
R?  RT0402BRE0750RL  [FP-RT0402-0_35-MFG]  (value not drawn)
R_?#1  RT0402BRE0710KL  [FP-RT0402-MFG]  (value not drawn)
R_?#2  RT0402BRE0710KL  [FP-RT0402-MFG]  (value not drawn)
R_?#3  RT0402BRE0710KL  [FP-RT0402-MFG]  (value not drawn)

### Ports
Flash SPI (harness Flash SPI, see root[4B], FPGA2[4A]), SDRAM (harness SDRAM, see root[4B], FPGA2[4C]), SDRAM CLK (harness SDRAM CLK, see root[4C], FPGA2[4B]), SDRAM_ADDR (harness SDRAM_ADDR, see root[4B], FPGA2[4C]), SDRAM_CMD (harness SDRAM CMD, see root[3B])

### Harnesses
Flash SPI: FLASH_CLK, FLASH_DO, FLASH MEM CS, FLASH DI
SDRAM: Data Bit 0, Data Bit 1, Data Bit 2, Data Bit 3, Data Bit 4, Data Bit 5, Data Bit 6, Data Bit 7, Data Bit 8, Data Bit 9, Data Bit 10, Data Bit 11, Data Bit 12, Data Bit 13, Data Bit 14, Data Bit 15
SDRAM_ADDR: ADDR 0, ADDR 1, ADDR 2, ADDR 3, ADDR 4, ADDR 5, ADDR 6, ADDR 7, ADDR 8, ADDR 9, ADDR 10, ADDR 11, ADDR 12
SDRAM CMD: Bank Select 0, Bank Select 1, Row Addr Strobe, Column Addr Strobe, Write Enable, Lower Byte Mask, Higher Byte Mask
SDRAM CLK: CLK Enable, CLK Input, SDRAM Select

### Nets
\: B1.1(VDD_1) B1.14(VDD_2) B1.27(VDD_3) C26.2 C27.2 C28.2 FLASH_MEM_1.8(VCC) R_?#1.2 R_?#2.1 R_?#3.1  [also labelled VCC]
GND: B1.28(VSS_1) B1.54(VSS_3) C26.1 C27.1 C28.1 FLASH_MEM_1.4(GND) FLASH_MEM_1.9(EP)
Address Bit 0: B1.23(A0) ; port SDRAM_ADDR.ADDR 0  [project net Addr Bit 0]
Address Bit 1: B1.24(A1) ; port SDRAM_ADDR.ADDR 1  [project net Addr Bit 1]
Address Bit 2: B1.25(A2) ; port SDRAM_ADDR.ADDR 2  [project net Addr Bit 2]
Address Bit 3: B1.26(A3) ; port SDRAM_ADDR.ADDR 3  [project net Addr Bit 3]
Address Bit 4: B1.29(A4) ; port SDRAM_ADDR.ADDR 4  [project net Addr Bit 4]
Address Bit 5: B1.30(A5) ; port SDRAM_ADDR.ADDR 5  [project net Addr Bit 5]
Address Bit 6: B1.31(A6) ; port SDRAM_ADDR.ADDR 6  [project net Addr Bit 6]
Address Bit 7: B1.32(A7) ; port SDRAM_ADDR.ADDR 7  [project net Addr Bit 7]
Address Bit 8: B1.33(A8) ; port SDRAM_ADDR.ADDR 8  [project net Addr Bit 8]
Address Bit 9: B1.34(A9) ; port SDRAM_ADDR.ADDR 9  [project net Addr Bit 9]
Address Bit 10: B1.22(A10) ; port SDRAM_ADDR.ADDR 10  [project net Addr Bit 10]
Address Bit 11: B1.35(A11) ; port SDRAM_ADDR.ADDR 11  [project net Addr Bit 11]
Address Bit 12: B1.36(A12) ; port SDRAM_ADDR.ADDR 12  [project net Addr Bit 12]
Bank Select 0: B1.20(BA0) ; port SDRAM_CMD.Bank Select 0
Bank Select 1: B1.21(BA1) ; port SDRAM_CMD.Bank Select 1
CLK Input: B1.38(CLK) ; port SDRAM CLK.CLK Input
CLK_Enable: B1.37(CKE) ; port SDRAM CLK.CLK Enable
Column Address Strobe: B1.17(~{CAS}) ; port SDRAM_CMD.Column Addr Strobe
Data Bit 0: B1.2(DQ0) ; port SDRAM.Data Bit 0
Data Bit 1: B1.4(DQ1) ; port SDRAM.Data Bit 1
Data Bit 2: B1.5(DQ2) ; port SDRAM.Data Bit 2
Data Bit 3: B1.7(DQ3) ; port SDRAM.Data Bit 3
Data Bit 4: B1.8(DQ4) ; port SDRAM.Data Bit 4
Data Bit 5: B1.10(DQ5) ; port SDRAM.Data Bit 5
Data Bit 6: B1.11(DQ6) ; port SDRAM.Data Bit 6
Data Bit 7: B1.13(DQ7) ; port SDRAM.Data Bit 7
Data Bit 8: B1.42(DQ8) ; port SDRAM.Data Bit 8
Data Bit 9: B1.44(DQ9) ; port SDRAM.Data Bit 9
Data Bit 10: B1.45(DQ10) ; port SDRAM.Data Bit 10
Data Bit 11: B1.47(DQ11) ; port SDRAM.Data Bit 11
Data Bit 12: B1.48(DQ12) ; port SDRAM.Data Bit 12
Data Bit 13: B1.50(DQ13) ; port SDRAM.Data Bit 13
Data Bit 14: B1.51(DQ14) ; port SDRAM.Data Bit 14
Data Bit 15: B1.53(DQ15) ; port SDRAM.Data Bit 15
FPGA_CLK: FLASH_MEM_1.6(CLK) ; port Flash SPI.FLASH_CLK
FPGA_DI: FLASH_MEM_1.2(DO_(IO1)) R?.1
FPGA_DI: R?.2 ; port Flash SPI.FLASH_DO  [a separate net that carries the same name]
FPGA_DO: FLASH_MEM_1.5(DI_(IO0)) ; port Flash SPI.FLASH DI
Higher Byte Mask: B1.39(DQMH) ; port SDRAM_CMD.Higher Byte Mask
Lower Byte Mask: B1.15(DQML) ; port SDRAM_CMD.Lower Byte Mask
MEM_CS: FLASH_MEM_1.1(~{CS}) R_?#1.1 ; port Flash SPI.FLASH MEM CS
Row Address Strobe: B1.18(~{RAS}) ; port SDRAM_CMD.Row Addr Strobe
SDRAM Select: B1.19(~{CS}) ; port SDRAM CLK.SDRAM Select
Write Enable: B1.16(~{WE}) ; port SDRAM_CMD.Write Enable
NetFLASH_MEM_1_3: FLASH_MEM_1.3(~{WP_(IO2)}) R_?#3.2
NetFLASH_MEM_1_7: FLASH_MEM_1.7(~{HOLD_(IO3)}) R_?#2.2

Not connected (* = marked no-connect by the designer): B1 3(VDDQ_1) 6(VSSQ_1) 9(VDDQ_2) 12(VSSQ_2) 40(NC)* 41(VSS_2) 43(VDDQ_3) 46(VSSQ_3) 49(VDDQ_4) 52(VSSQ_4)

### Notes on the sheet
- (near R_?#1) Flash Memeory

### Library data of the parts
B1 = CMP-007-000000-1: DRAM 256M, 3.3V, SDRAM 16Mx16 143MHz; Manufacturer_Name: Integrated Silicon Solution Inc.; Geometry.Height: 1.2mm; Mouser Part Number: 870-IS42S16160J-7TLI; Mouser Price/Stock: https://www.mouser.co.uk/ProductDetail/ISSI/IS42S16160J-7TLI?qs=uCnMRCNammmen%252BmWnq1g5A%3D%3D; Source: IS42S16160J-7TLI.SchLib; Datasheet Link: http://www.issi.com/WW/pdf/42-45S83200J-16160J.pdf; Manufacturer_Part_Number: IS42S16160J-7TLI; Design Item ID: IS42S16160J-7TLI
C26 = CMP-2006-02157-1: Manufacturer: AVX Interconnect / Elco; Part Number: LD033C104KAB2A
C27 = CMP-06035-028467-1: Chip Multilayer Ceramic Capacitors for General Purpose, 0805, 4.7uF, X5R, 15%, 20%, 25V
C28 = CMP-2006-02241-1: Manufacturer: Kemet; Part Number: C0603C105K9PACTU
FLASH_MEM_1 = W25N01GVZEIGTR: Integrated Circuit; Manufacturer_Name: Winbond; Datasheet Link: http://www.winbond.com/resource-files/w25n01gv%20revl%20050918%20unsecured.pdf; Height: 0.8mm; Manufacturer_Part_Number: W25N01GVZEIGTR
R? = CMP-00621-71392720-1: RT0402BRE0750RL Fixed Resistor, Thin Film, 0.0625W, 50ohm, 50V, 0.1% +/-Tol, 50ppm/Cel, Surface Mount, 0402; Max Power Dissipation: 63mW; Temperature Coefficient: 50ppm/°C; Resistance: 50Ω; Features: Moisture Resistant; Max Operating Temperature: 155°C; Tolerance: 0.1%; Min Operating Temperature: -55°C; Case/Package: 0402; Packaging: Tape & Reel; RoHS: Compliant; Width: 508µm; Height: 355.6µm; NexarPartId: 71392720; Composition: Thin Film; Length: 990.6µm; Number of Terminations: 2
R_?#1-R_?#3 = CMP-2002-02973-2: as R_STDBY1 on sheet FPGA1; Octopart: https://octopart.com/rt0402bre0710kl-yageo-1416557; Digikey Description: RES SMD 10K OHM 0.1% 1/16W 0402; Category: Res; Temperature Range Low: -55°C; Ipc Land Pattern Name: RESC10050X30; Manufacturer Part Number: RT0402BRE0710KL; Automotive: No; Package: RT0402; Temperature: -55°C to +155°C; Series: RT; Lead Free: Yes; Device Class L3: Chip SMD Resistors; ComponentLink2URL: http://www.yageo.com/documents/recent/PYu-RT_1-to-0.01_RoHS_L_9.pdf; Height: 0.35mm; ComponentLink2Description: Datasheet; RoHS: TRUE; Composition: Thin Film; Device Class L2: Resistors; Device Class L1: Passive Components; Temperature Range High: +155°C; Footprint Url: http://www.yageo.com/exep/pages/download/literatures/PYu-R_Mount_10.pdf; Mouser Description: Res Thin Film 0402 10K Ohm 0.1% 1/16W ±50ppm/°C Molded SMD Paper T/R

## Sheet Connectors.SchDoc
size A4; SheetNumber: 6; SheetTotal: 9
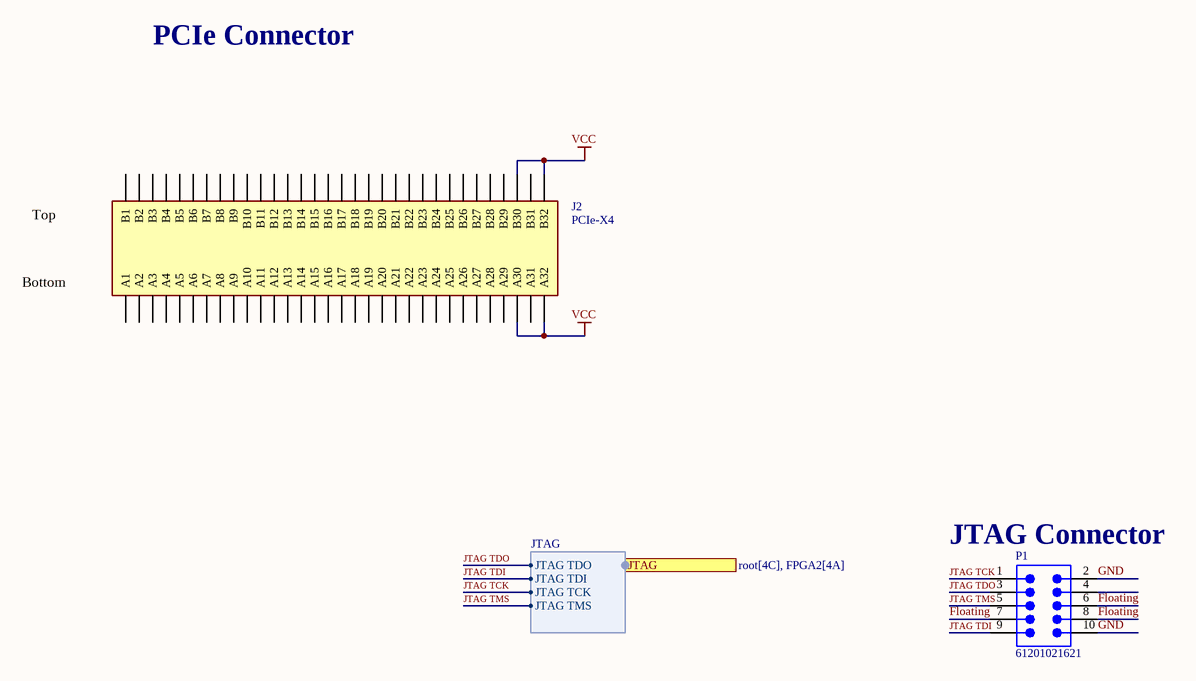
[diagram p5: Connectors.SchDoc]

### Parts
J2  PCIe-X4  [BUS_PCIexpress_x4]  (no BOM)
P1  61201021621  [61201021621]

### Ports
JTAG (harness JTAG, see root[4C], FPGA2[4A])

### Harnesses
JTAG: JTAG TDO, JTAG TDI, JTAG TCK, JTAG TMS

### Nets
VCC: J2.A30 J2.A32 J2.B30 J2.B32  [project net \]
Floating: P1.6 P1.7 P1.8
GND: P1.2 P1.10
JTAG TCK: P1.1 ; port JTAG.JTAG TCK
JTAG TDI: P1.9 ; port JTAG.JTAG TDI
JTAG TDO: P1.3 ; port JTAG.JTAG TDO
JTAG TMS: P1.5 ; port JTAG.JTAG TMS

Not connected (* = marked no-connect by the designer): J2 A1 A2 A3 A4 A5 A6 A7 A8 A9 A10 A11 A12 A13 A14 A15 A16 A17 A18 A19 A20 A21 A22 A23 A24 A25 A26 A27 A28 A29 A31 B1 B2 B3 B4 B5 B6 B7 B8 B9 B10 B11 B12 B13 B14 B15 B16 B17 B18 B19 B20 B21 B22 B23 B24 B25 B26 B27 B28 B29 B31; P1 4

### Notes on the sheet
- PCIe Connector
- Top
- Bottom
- (near P1) JTAG Connector

### Library data of the parts
P1 = CMP-1502-00007-2: NexarPartId: 8917783; Number of Contacts: 10; Voltage Rating (DC): 250V; Insulation Resistance: 1GΩ; Current Rating: 3A; Row Spacing: 2.54mm; Contact Resistance: 20mΩ; Connector Type: Male Pin; Gender: Male; Flammability Rating: UL94 V-0; Termination: Solder; Width: 20.36mm; Length: 20.36mm; Housing Material: PBT; Operating Supply Voltage: 250V; Min Operating Temperature: -40°C; Lead Free: Lead Free; Insulation Material: PBT; Orientation: Vertical; RoHS: Compliant; Voltage Rating: 250V; Number of Pins: 10; Height: 8.85mm; REACH SVHC: Unknown; Contact Material: Copper; Contact Gender: Male; Color: Black; Mount: Through Hole; Contact Plating: Gold; Lead Pitch: 2.54mm; Number of Positions: 10; Pitch: 2.54mm; Max Operating Temperature: 105°C; Number of Rows: 2

## Sheet MCU.SchDoc
size A4; SheetNumber: 7; SheetTotal: 9
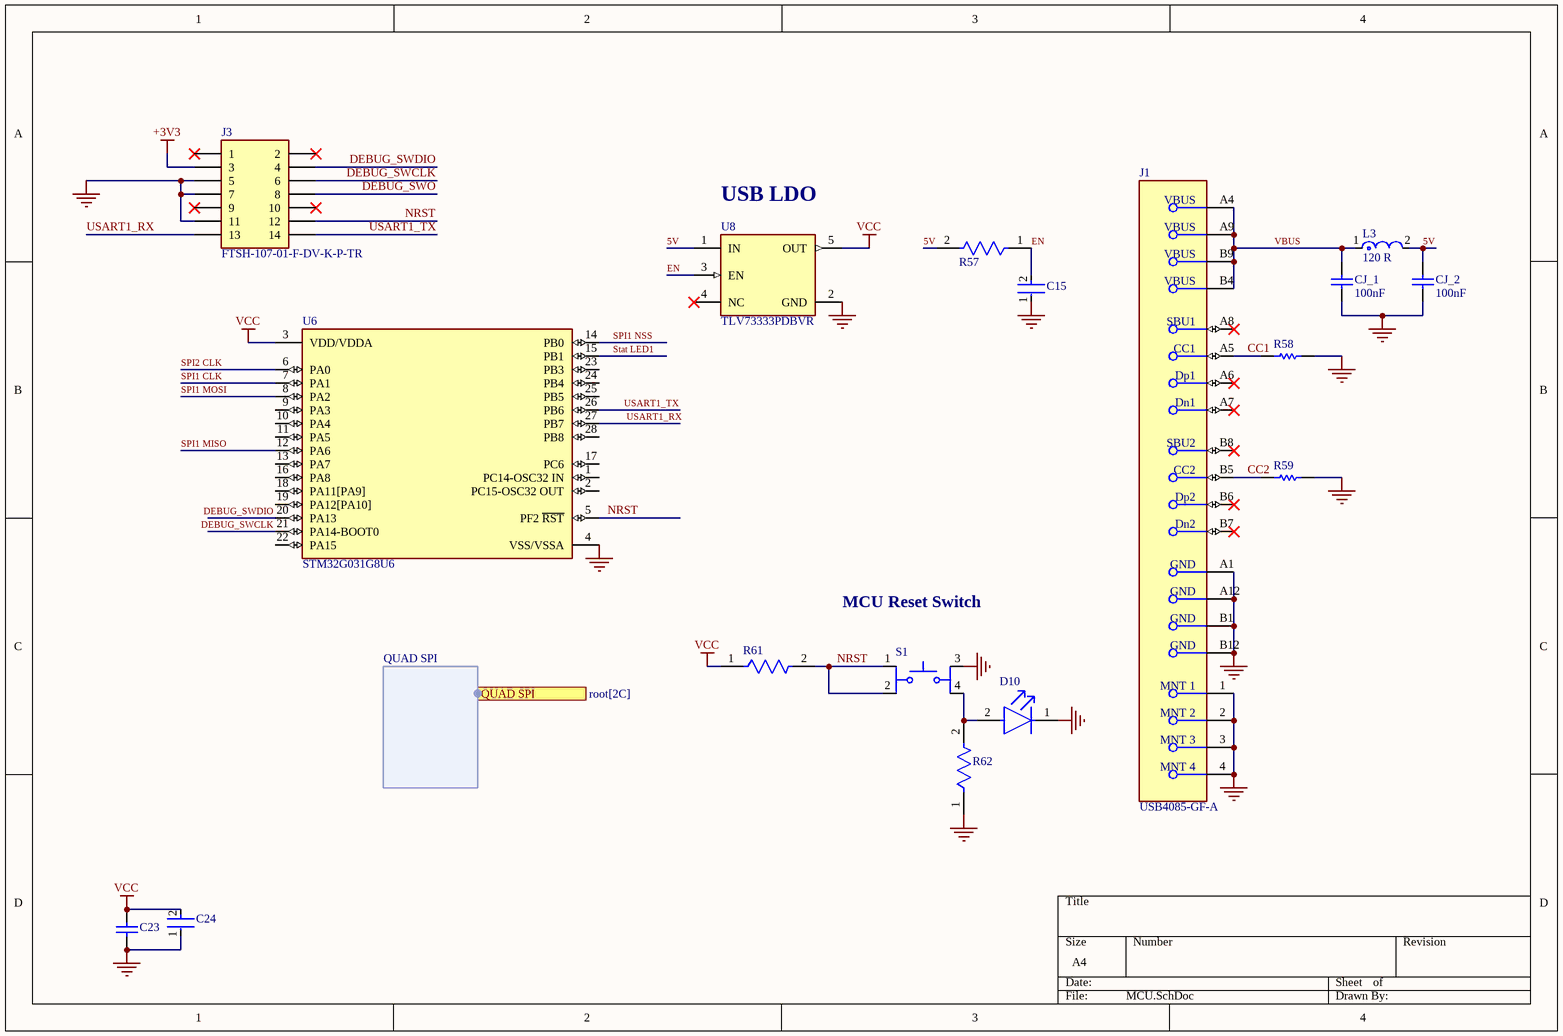
[diagram p6: MCU.SchDoc]

### Parts
C15  C1608X5R1H105K080AB  [FP-C1608-080-0_1-IPC_B]  (value not drawn)
C23  LD033C104KAB2A  [CAPC1608X90X35NL15T15]  (value not drawn)
C24  GRM219R61E475MA73J  [FP-GRM219-0_15-0_1-IPC_B]  (value not drawn)
CJ_1  100nF  [CAPC1206(3216)170_L]
CJ_2  100nF  [CAPC1206(3216)170_L]
D10  LTST-C170GKT  [FP-LTST-C170GKT-MFG]  (value not drawn)
J1  USB4085-GF-A  [FP-USB4085-GF-A-MFG]
J3  FTSH-107-01-F-DV-K-P-TR  [FTSH-107-XX-YYY-DV-K-P-TR]
L3  120 R  [FP-LQG15HH_02-MFG]
R57  RC0603FR-0710KL  [FP-RC0603-0_55-IPC_C]  (value not drawn)
R58  RC0603FR-075K1L  [RESC1608X55X25ML10T15]  (value not drawn)
R59  RC0603FR-075K1L  [RESC1608X55X25ML10T15]  (value not drawn)
R61  AC0603JR-0747KL  [FP-AC0603-IPC_A]  (value not drawn)
R62  TFCR0402-16W-C-1002BT  [FP-TFCR0402-IPC_B]  (value not drawn)
S1  TL3365AF180QG  [SW_TL3365AF180QG]  (value not drawn)
U6  STM32G031G8U6  [FP-UFQFPN28-A0B0-MFG]
U8  TLV73333PDBVR  [FP-DBV0005A-MFG]

### Ports
QUAD SPI (harness QUAD SPI, see root[2C])

### Harnesses
QUAD SPI: 

### Nets
+3V3: J3.3
GND: C15.1 C23.1 C24.1 CJ_1.1 CJ_2.1 D10.1(C) J1.1(MNT_1) J1.2(MNT_2) J1.3(MNT_3) J1.4(MNT_4) J1.A1(GND) J1.A12(GND) J1.B1(GND) J1.B12(GND) J3.5 J3.7 J3.11 R58.2 R59.2 R62.1 S1.3 U6.4(VSS/VSSA) U8.2(GND)
VCC: C23.2 C24.2 R61.1 U6.3(VDD/VDDA) U8.5(OUT)  [project net \]
5V: CJ_2.2 L3.2 R57.2 U8.1(IN)
CC1: J1.A5(CC1) R58.1
CC2: J1.B5(CC2) R59.1
DEBUG_SWCLK: J3.6 U6.21(PA14-BOOT0)
DEBUG_SWDIO: J3.4 U6.20(PA13)
DEBUG_SWO: J3.8
EN: C15.2 R57.1 U8.3(EN)
NRST: J3.12 R61.2 S1.1 S1.2 U6.5(PF2_~{RST})
SPI1 CLK: U6.7(PA1)
SPI1 MISO: U6.12(PA6)
SPI1 MOSI: U6.8(PA2)
SPI1 NSS: U6.14(PB0)
SPI2 CLK: U6.6(PA0)
Stat LED1: U6.15(PB1)
USART1_RX: J3.13 U6.27(PB7)
USART1_TX: J3.14 U6.26(PB6)
VBUS: CJ_1.2 J1.A4(VBUS) J1.A9(VBUS) J1.B4(VBUS) J1.B9(VBUS) L3.1
NetD10_2: D10.2(A) R62.2 S1.4

Not connected (* = marked no-connect by the designer): J1 A6(Dp1)* A7(Dn1)* A8(SBU1)* B6(Dp2)* B7(Dn2)* B8(SBU2)*; J3 1* 2* 9* 10*; U6 1(PC14-OSC32_IN) 2(PC15-OSC32_OUT) 9(PA3) 10(PA4) 11(PA5) 13(PA7) 16(PA8) 17(PC6) 18(PA11[PA9]) 19(PA12[PA10]) 22(PA15) 23(PB3) 24(PB4) 25(PB5) 28(PB8); U8 4(NC)*

### Notes on the sheet
- (near U8) USB LDO
- MCU Reset Switch

### Library data of the parts
C15 = CMP-2000-06025-2: Multilayer Ceramic Capacitors 1μF ±10% 50V X5R SMD 0603; Capacitance: 1uF; Lead Free: Lead Free; Height: 0.8mm; Mount: Surface Mount; Radiation Hardening: No; Thickness: 0.035inch; Length: 1.6mm; Max Operating Temperature: 85°C; REACH SVHC: No SVHC; Min Operating Temperature: -55°C; Construction: Flat; RoHS Compliant: Yes; Voltage Rating: 50V; Dielectric: X5R; Packaging: Tape and Reel; Termination: SMD/SMT; Voltage Rating (DC): 50V; Case Code (Imperial): 0603; Voltage: 50V; Width: 0.031inch; Weight: 7.1E-05oz; Depth: 0.8mm; Case Code (Metric): 1608; Series: C; Case/Package: 0603; Tolerance: 10%; Resistor Type: Ceramic; Number of Pins: 2; Dielectric Material: Ceramic; Package Quantity: 1
C23 = CMP-2006-02157-1: Manufacturer: AVX Interconnect / Elco; Part Number: LD033C104KAB2A
C24 = CMP-06035-028467-1: as C27 on sheet Memory
CJ_1 CJ_2 = CMP-1037-04188-1: CAP 100nF 25V ±5% 1206 (3216 Metric) Thickness 1.7mm SMD; Case-Metric: 3216; Case-EIA: 1206; Tolerance: Â±5%; Max Thickness: 1.7 mm; Value: 100nF; Technology: SMT; Rated Voltage: 25 V
D10 = CMP-1674-00002-6: LED GREEN CLEAR SMD; Dominant Wavelength: 569nm; Lens Style: Diffused; Forward Voltage: 2.1V; Number of Elements: 1; Wavelength: 565nm; Luminous Intensity: 6mcd; Test Current: 10mA; Power Dissipation: 100mW; Reverse Voltage: 5V; Forward Current: 30mA; Viewing Angle: 130°; Lens Color: Colorless; Min Operating Temperature: -55°C; Number of Pins: 2; Max Operating Temperature: 85°C; Color: Green; Radiation Hardening: No; Illumination Color: Green; Case Code (Metric): 2012; Lens Transparency: Clear; Case/Package: 0805; Width: 1.25mm; Case Code (Imperial): 0805; Package Quantity: 1; Height: 1.1mm; Depth: 1.25mm; Length: 2mm; Power Rating: 100mW; Lead Free: Lead Free; Number of LEDs: 1; Packaging: Tape and Reel; Mount: Surface Mount; Voltage: 5V
J1 = CMP-196119-000001-2: CONN RCPT USB2.0 TYPE C 24POS RA; Gender: Receptacle; Number of Positions: 16; USB Standard: USB 2.0; Orientation: Right Angle; Contact Plating: Gold; Contact Material: Copper Alloy
J3 = FTSH-107-01-F-DV-K-P-TR: Connector Header Surface Mount 14 position 0.050" (1.27mm); Manufacturer_Name: SAMTEC; Datasheet Link: http://suddendocs.samtec.com/prints/ftsh-1xx-xx-xxx-dv-xxx-xxx-mkt.pdf; Manufacturer_Part_Number: FTSH-107-01-F-DV-K-P-TR; Mouser Part Number: 200-FTSH10701FDVKPTR; Mouser Price/Stock: https://www.mouser.co.uk/ProductDetail/Samtec/FTSH-107-01-F-DV-K-P-TR?qs=%252BZP6%2F%252BtExtAI0atx6lcXTg%3D%3D; Arrow Part Number: FTSH-107-01-F-DV-K-P-TR; Arrow Price/Stock: https://www.arrow.com/en/products/ftsh-107-01-f-dv-k-p-tr/samtec?utm_currency=USD&region=nac; LCSC Part #: C5276598; Manu Part #: FTSH-107-01-F-DV-K-P-TR
L3 = CMP-06042-008586-1: Multilayer type RF Inductor 8.2nH ±5% 0.25Ω 500mA 0402; Core Material: Air; Shielding: Unshielded; Current Rating: 300mA; Test Frequency: 100MHz; Self Resonant Frequency: 3.6GHz; Q Factor: 8; DC Resistance (DCR): 330mR; Case/Package: 0402; Max Operating Temperature: 125°C; Military Standard: Not; Depth: 0.55mm; Lead Free: Lead Free; DC Current: 300mA; Length: 1mm; Height: 0.02inch; Width: 0.5mm; Termination: SMD/SMT; Max DC Current: 300mA; Min Operating Temperature: -55°C; Height - Seated (Max): 0.022inch; Radiation Hardening: No; Inductance: 8.2nH; Packaging: Tape and Reel; REACH SVHC: No SVHC; Case Code (Imperial): 0402; Package Quantity: 1; Tolerance: 5%; Case Code (Metric): 1005; Mount: Surface Mount; Inductance Tolerance: 5%
R57 = CMP-2100-03664-2: as R9 on sheet Power; Depth: 0.8mm; Termination: SMD/SMT; Resistor Type: Thick Film; Series: RC; Construction: Rectangular; Features: Moisture Resistant; Packaging: Tape and Reel; Min Operating Temperature: -55°C; Number of Terminations: 2; Lead Pitch: 0.3mm; RoHS Compliant: Yes; Case/Package: 0603; Resistance Tolerance: 1%; Military Standard: Not; Weight: 7.1E-05oz; Number of Pins: 2; Tolerance: 1%; Length: 1.6mm; Case Code (Imperial): 0603; Lead Free: Lead Free; Width: 0.8mm; Max Power Dissipation: 100mW; Height: 0.45mm; Max Operating Temperature: 155°C; Case Code (Metric): 1608; Size Code: 0603
R58 R59 = CMP-2000-04091-1: Manufacturer: Yageo; Part Number: RC0603FR-075K1L
R61 = CMP-03412-049221-1: RES 47kΩ 5.00% 0.1W 0603; Resistance: 47kR; Tolerance: 5%; Temperature Coefficient: 100ppm/°C; Max Power Dissipation: 100mW; Voltage Rating: 50V; Packaging: Tape and Reel; Series: AC; Ratings: AEC-Q200; Case Code (Metric): 1608; Case Code (Imperial): 0603; Resistor Type: Thick Film; Max Operating Temperature: 155°C; Case/Package: 0603; Features: Moisture Resistant; Height: 0.45mm; Termination: SMD/SMT; Length: 1.6mm; Min Operating Temperature: -55°C; Number of Terminations: 2; Width: 0.8mm; RoHS Compliant: Yes; Power Rating: 100mW
R62 = CMP-250906-167145-1: RES Thin Film,  10kΩ, 0.1%, 0.063W, 50ppm/°C, 0402
S1 = TL3365AF180QG: Tactile Switch SPST-NO Top Actuated Surface Mount; MF: E-Switch; SnapEDA_Link: https://www.snapeda.com/parts/TL3365AF180QG/E-Switch/view-part/?ref=snap; Package: None; Value: *; MP: TL3365AF180QG; Check_prices: https://www.snapeda.com/parts/TL3365AF180QG/E-Switch/view-part/?ref=eda
U6 = CMP-12105-000108-1: IC MCU 32BIT 64KB FLASH 28UFQFPN
U8 = CMP-04917-000053-1: IC REG LINEAR 3.3V 300MA SOT23-5; Manufacturer: Texas Instruments; Max Junction Temp: +125°C; Accuracy Percentage: 1%; Min Supply Voltage: 1.4V; Number Of Outputs: 1; Dropout Voltage: 125mV; Nominal Supply Current: 34uA; Max Supply Voltage: 5.5V; Output Type: Fixed; Standoff Height: 0mm; Digikey Description: IC REG LINEAR 3.3V 300MA SOT23-5; Manufacturer Part Number: TLV73333PDBVR; Temperature Range High: +125°C; Temperature: -40°C to +125°C; Output Current: 300mA; Mouser Description: LDO Voltage Regulators Capacitr-Free 300-mA 5-SOT-23 -40 to 125; Automotive: No; Height: 1.45mm; Device Class L3: Voltage Regulators - Linear; ComponentLink2Description: Datasheet; Device Class L1: Integrated Circuits (ICs); ComponentLink2URL: http://www.ti.com/lit/ds/symlink/tlv733p.pdf; Octopart: https://octopart.com/tlv73333pdbvr-texas+instruments-51080890; Temperature Range Low: -40°C; RoHS: TRUE; Lead Free: Yes; Output Voltage: 3.3V; Package: DBV0005A; Device Class L2: Power Management ICs; Category: IC